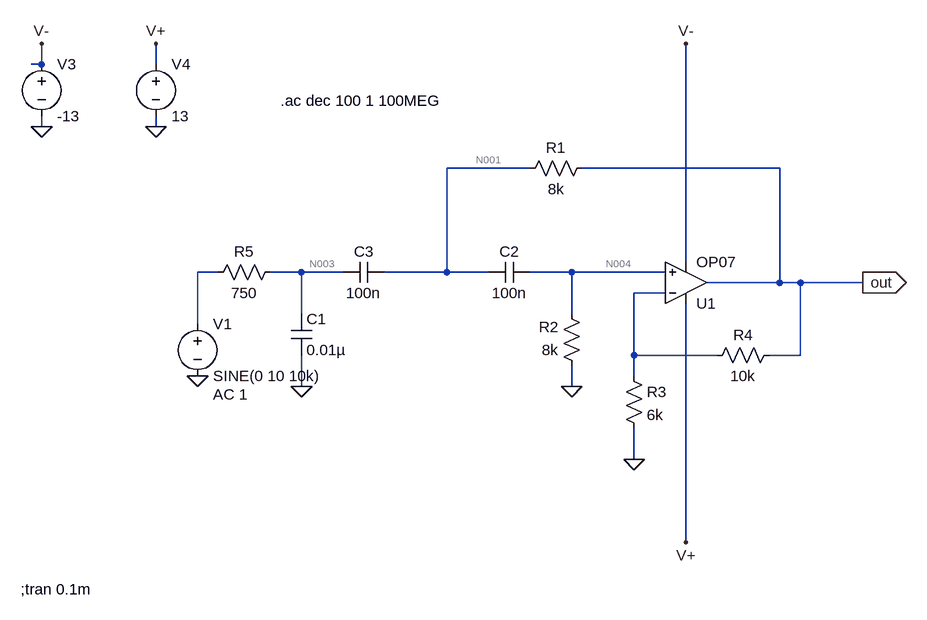
[diagram p0: schematic salle_key_filter.asc]
salle_key_filter.asc, the LTspice schematic file:
Version 4
SHEET 1 880 680
WIRE -672 -288 -672 -320
WIRE -672 -288 -688 -288
WIRE -496 -288 -496 -320
WIRE -672 -192 -672 -208
WIRE -496 -192 -496 -208
WIRE 80 -128 -48 -128
WIRE 464 -128 160 -128
WIRE 320 16 320 -320
WIRE -400 32 -432 32
WIRE -272 32 -320 32
WIRE -208 32 -272 32
WIRE -48 32 -48 -128
WIRE -48 32 -144 32
WIRE 16 32 -48 32
WIRE 144 32 80 32
WIRE 288 32 144 32
WIRE 464 48 464 -128
WIRE 464 48 352 48
WIRE 496 48 464 48
WIRE 592 48 496 48
WIRE 288 64 240 64
WIRE -272 96 -272 32
WIRE 144 96 144 32
WIRE -432 112 -432 32
WIRE 240 160 240 64
WIRE 368 160 240 160
WIRE 496 160 496 48
WIRE 496 160 448 160
WIRE 240 192 240 160
WIRE -272 208 -272 160
WIRE 144 208 144 176
WIRE 240 320 240 272
WIRE 320 448 320 80
FLAG 592 48 out
IOPIN 592 48 Out
FLAG 240 320 0
FLAG 144 208 0
FLAG -272 208 0
FLAG -432 192 0
FLAG -496 -320 V+
FLAG -672 -320 V-
FLAG -496 -192 0
FLAG -672 -192 0
FLAG 320 448 V+
FLAG 320 -320 V-
SYMBOL OpAmps\\OP07 320 112 M180
SYMATTR InstName U1
SYMBOL cap 80 16 R90
WINDOW 0 0 32 VBottom 2
WINDOW 3 32 32 VTop 2
SYMATTR InstName C2
SYMATTR Value 100n
SYMBOL res 176 -144 R90
WINDOW 0 0 56 VBottom 2
WINDOW 3 32 56 VTop 2
SYMATTR InstName R1
SYMATTR Value 8k
SYMBOL res 160 192 R180
WINDOW 0 36 76 Left 2
WINDOW 3 36 40 Left 2
SYMATTR InstName R2
SYMATTR Value 8k
SYMBOL res 224 176 R0
SYMATTR InstName R3
SYMATTR Value 6k
SYMBOL res 464 144 R90
WINDOW 0 0 56 VBottom 2
WINDOW 3 32 56 VTop 2
SYMATTR InstName R4
SYMATTR Value 10k
SYMBOL voltage -432 96 R0
WINDOW 123 24 124 Left 2
WINDOW 39 0 0 Left 0
SYMATTR Value2 AC 1
SYMATTR InstName V1
SYMATTR Value SINE(0 10 10k)
SYMBOL res -304 16 R90
WINDOW 0 0 56 VBottom 2
WINDOW 3 32 56 VTop 2
SYMATTR InstName R5
SYMATTR Value 750
SYMBOL cap -288 96 R0
SYMATTR InstName C1
SYMATTR Value 0.01µ
SYMBOL voltage -672 -304 R0
WINDOW 123 0 0 Left 0
WINDOW 39 0 0 Left 0
SYMATTR InstName V3
SYMATTR Value -13
SYMBOL voltage -496 -304 R0
WINDOW 123 0 0 Left 0
WINDOW 39 0 0 Left 0
SYMATTR InstName V4
SYMATTR Value 13
SYMBOL cap -144 16 R90
WINDOW 0 0 32 VBottom 2
WINDOW 3 32 32 VTop 2
SYMATTR InstName C3
SYMATTR Value 100n
TEXT -704 520 Left 2 !;tran 0.1m
TEXT -304 -232 Left 2 !.ac dec 100 1 100MEG

The netlist it stands for:
* salle_key_filter.asc
XU1 N004 N005 V+ V- out LT1001  ; OP07, pins In+ In- V+ V- OUT
C2 N004 N001 100n
R1 out N001 8k
R2 0 N004 8k
R3 N005 0 6k
R4 out N005 10k
V1 N002 0 SINE(0 10 10k) AC 1
R5 N003 N002 750
C1 N003 0 0.01µ
V3 V- 0 -13
V4 V+ 0 13
C3 N001 N003 100n
;tran 0.1m
.ac dec 100 1 100MEG
.lib LTC.lib
.backanno
.end

* Results of the author's LTspice run, read from the files saved beside the schematic
* Operating Point, zero values left out:
*   V(v+) = 13 V
*   V(v-) = -13 V
*   I(V4) = -2.25 mA
*   I(V3) = 2.25 mA
*   Ix(u1:3) = 2.25 mA
*   Ix(u1:4) = -2.25 mA
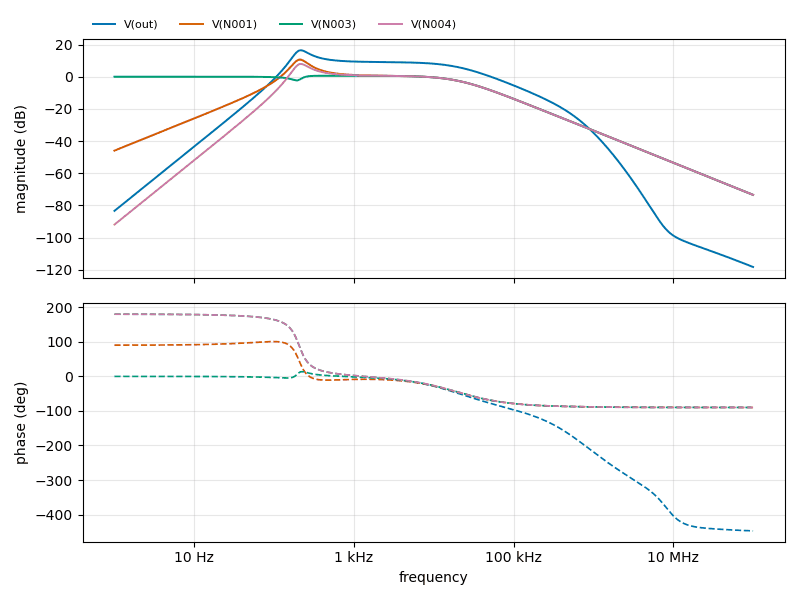
[diagram p1: AC Analysis of salle_key_filter.asc, plotted from the saved traces]
* AC Analysis, 1 run:
*   V(out): -83.43 dB at 1 Hz, -118.30 dB at 100 MHz, peak 16.41 dB at 213.8 Hz, 3 dB below the peak at 177.9 Hz and 298.8 Hz
*   V(N001): -45.97 dB at 1 Hz, -73.47 dB at 100 MHz, peak 10.61 dB at 208.9 Hz, 3 dB below the peak at 171.7 Hz and 274.3 Hz
*   V(N003): -0.00 dB at 1 Hz, -73.47 dB at 100 MHz, peak 0.58 dB at 478.6 Hz, 3 dB below the peak at 19.47 kHz
*   V(N004): -91.95 dB at 1 Hz, -73.47 dB at 100 MHz, peak 7.89 dB at 213.8 Hz, 3 dB below the peak at 177.9 Hz and 298.8 Hz